# EasyEDA schematic 1-Schematic_Twin-T_Bassdrum_Krakenpine.json
TITLE: Krakenpines Twin-T Bassdrum; REV: 1.0; Date: 2025-04-01; Sheet: 1/1; Drawn By: Tilman
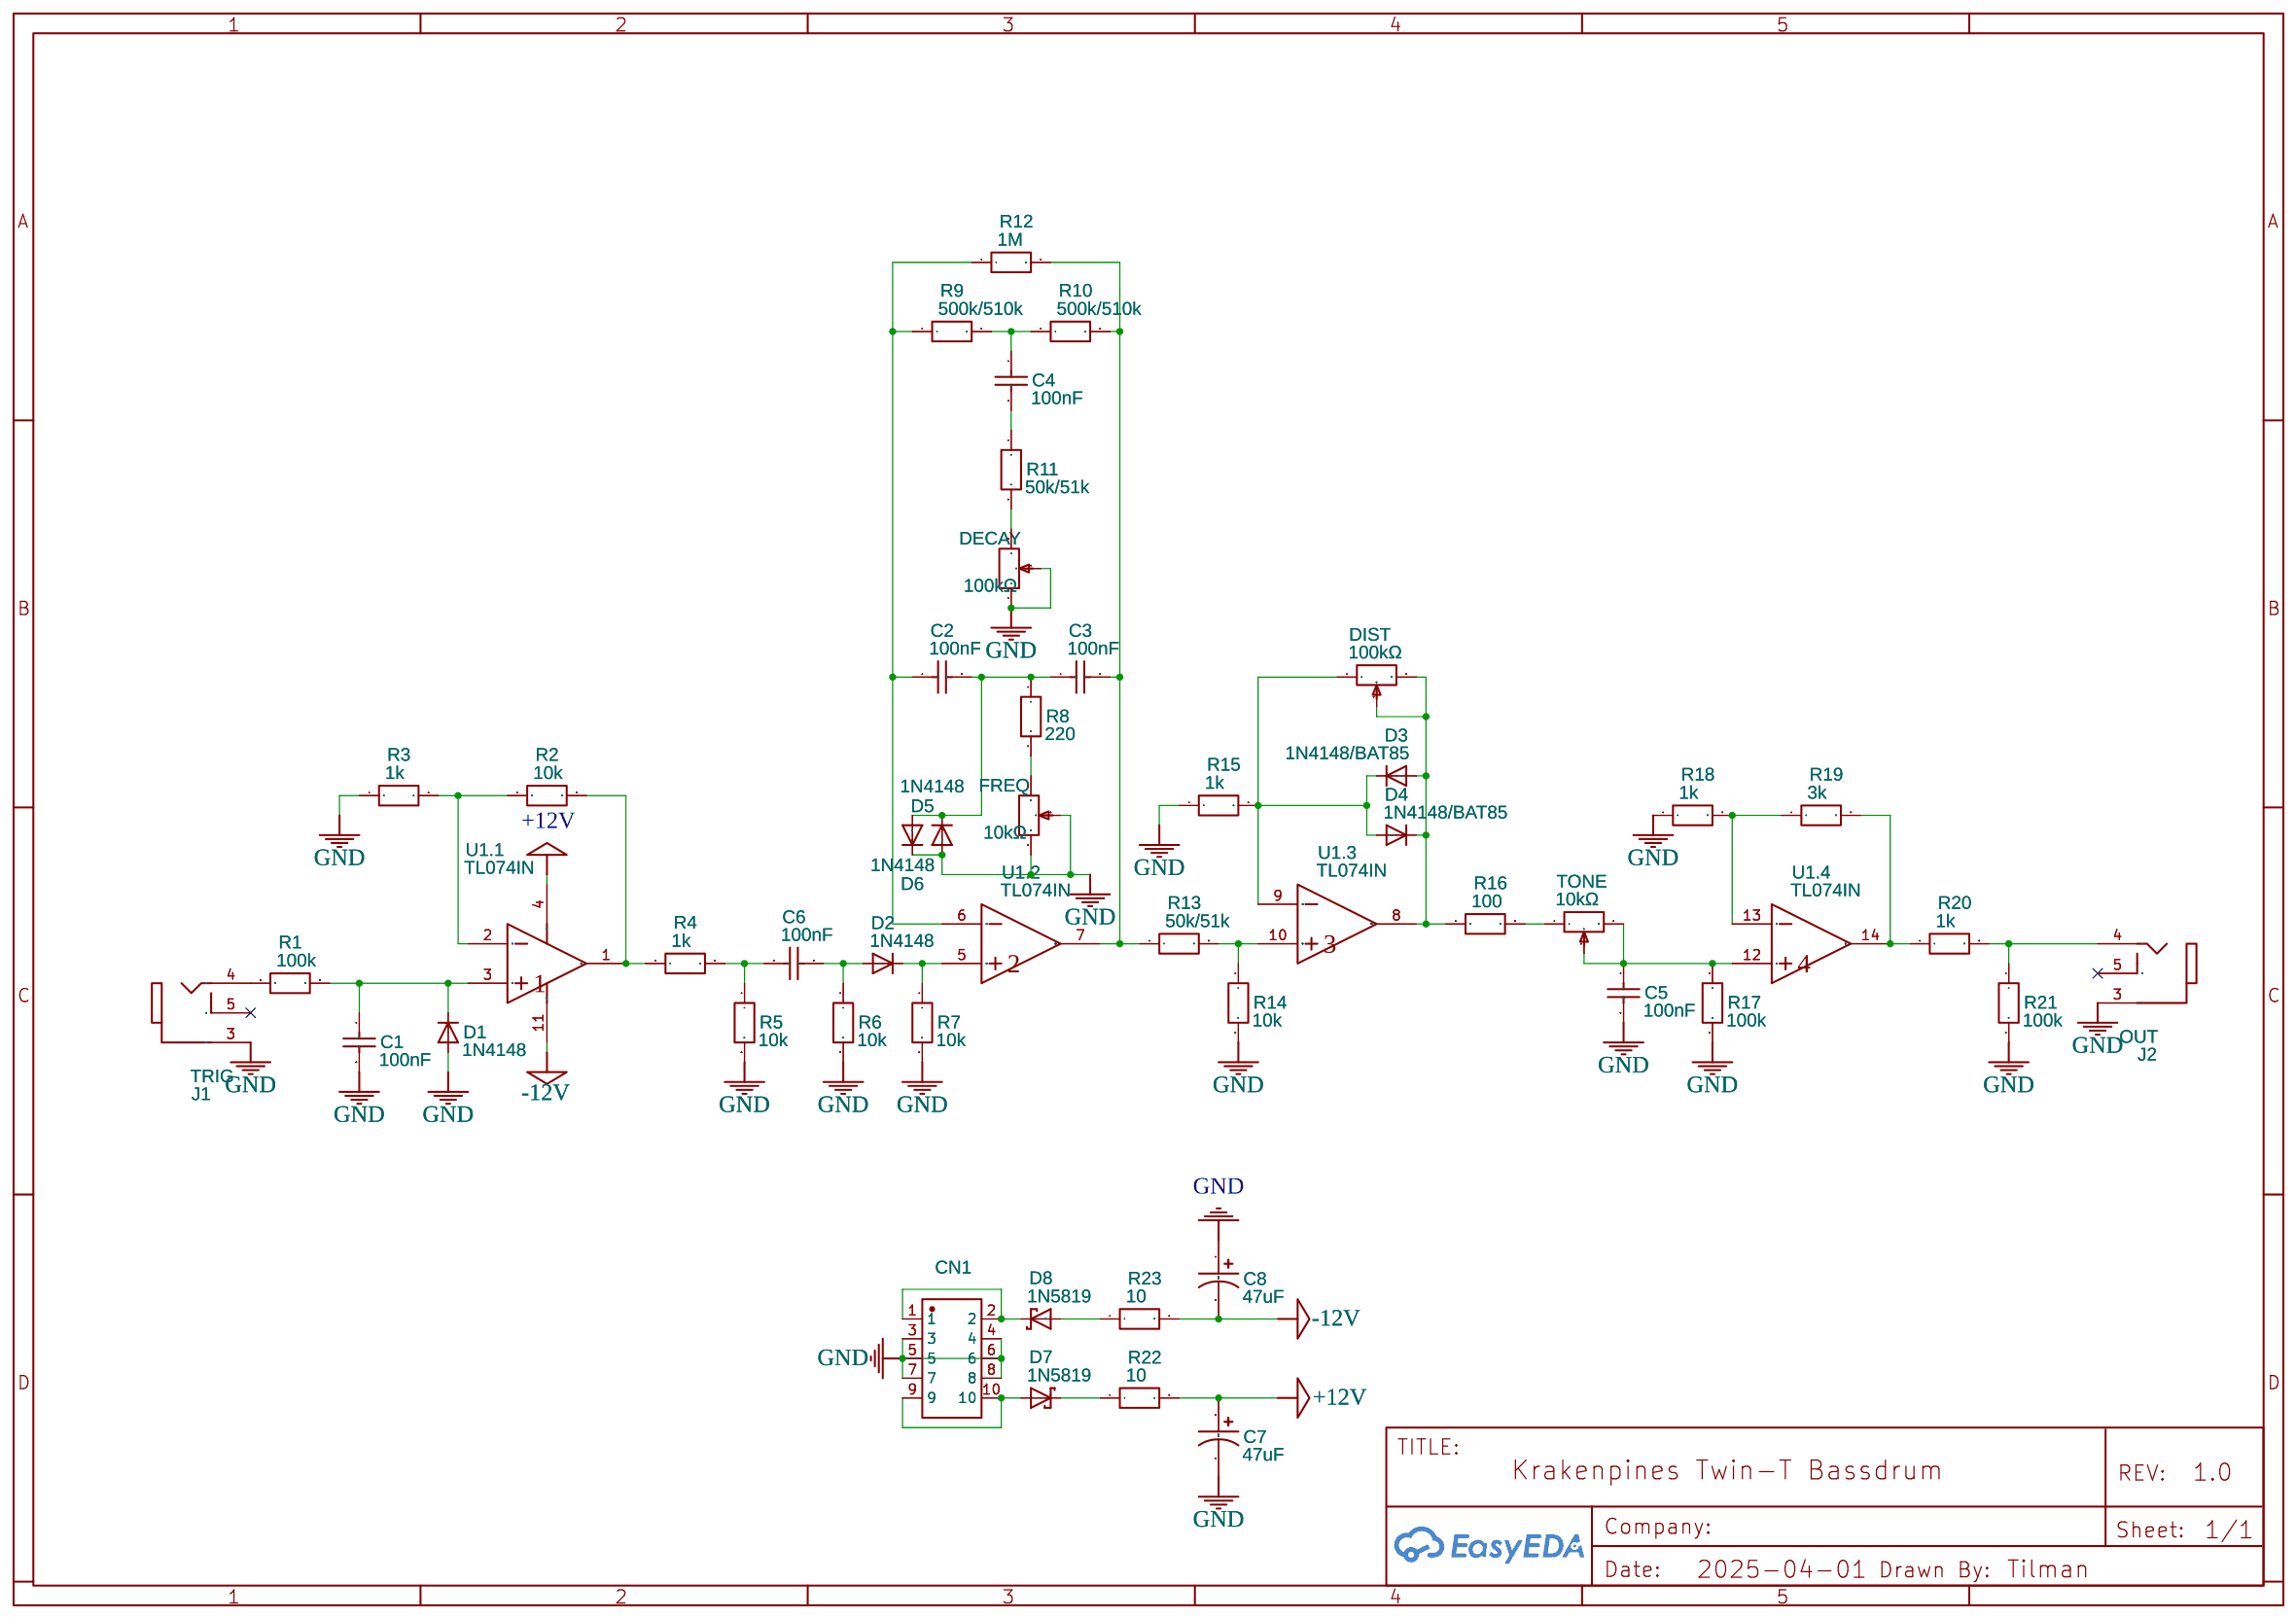
[diagram p0: schematic sheet]

## Parts
C1  100nF  [CAP-2.5*6.5*7.2]
C2  100nF  [CAP-2.5*6.5*7.2]
C3  100nF  [CAP-2.5*6.5*7.2]
C4  100nF  [CAP-2.5*6.5*7.2]
C5  100nF  [CAP-2.5*6.5*7.2]
C6  100nF  [CAP-2.5*6.5*7.2]
C7  47uF  [CAP-TH_BD5.0-P2.00-D0.5-FD]
C8  47uF  [CAP-TH_BD5.0-P2.00-D0.5-FD]
CN1  DC3-2.54-10PAS  [CONN-TH_10P-P2.54_DC3-2.54-10PAS]
D1  1N4148  [DIODE-1N4148]
D2  1N4148  [DIODE-1N4148]
D3  1N4148/BAT85  [DIODE-1N4148]
D4  1N4148/BAT85  [DIODE-1N4148]
D5  1N4148  [DIODE-1N4148]
D6  1N4148  [DIODE-1N4148]
D7  1N5819  [DO41-7.6]
D8  1N5819  [DO41-7.6]
DECAY  100kΩ  [RES-ADJ-TH_RK097111080J]
DIST  100kΩ  [RES-ADJ-TH_RK097111080J]
FREQ  10kΩ  [RES-ADJ-TH_RK097111080J]
J1  TRIG  [PJM323 TAYDA A-2557]
J2  OUT  [PJM323 TAYDA A-2557]
R1  100k  [RES-TH_BD2.4-L6.3-P10.30-D0.6]
R2  10k  [RES-TH_BD2.4-L6.3-P10.30-D0.6]
R3  1k  [RES-TH_BD2.4-L6.3-P10.30-D0.6]
R4  1k  [RES-TH_BD2.4-L6.3-P10.30-D0.6]
R5  10k  [RES-TH_BD2.4-L6.3-P10.30-D0.6]
R6  10k  [RES-TH_BD2.4-L6.3-P10.30-D0.6]
R7  10k  [RES-TH_BD2.4-L6.3-P10.30-D0.6]
R8  220  [RES-TH_BD2.4-L6.3-P10.30-D0.6]
R9  500k/510k  [RES-TH_BD2.4-L6.3-P10.30-D0.6]
R10  500k/510k  [RES-TH_BD2.4-L6.3-P10.30-D0.6]
R11  50k/51k  [RES-TH_BD2.4-L6.3-P10.30-D0.6]
R12  1M  [RES-TH_BD2.4-L6.3-P10.30-D0.6]
R13  50k/51k  [RES-TH_BD2.4-L6.3-P10.30-D0.6]
R14  10k  [RES-TH_BD2.4-L6.3-P10.30-D0.6]
R15  1k  [RES-TH_BD2.4-L6.3-P10.30-D0.6]
R16  100  [RES-TH_BD2.4-L6.3-P10.30-D0.6]
R17  100k  [RES-TH_BD2.4-L6.3-P10.30-D0.6]
R18  1k  [RES-TH_BD2.4-L6.3-P10.30-D0.6]
R19  3k  [RES-TH_BD2.4-L6.3-P10.30-D0.6]
R20  1k  [RES-TH_BD2.4-L6.3-P10.30-D0.6]
R21  100k  [RES-TH_BD2.4-L6.3-P10.30-D0.6]
R22  10  [RES-TH_BD2.4-L6.3-P10.30-D0.6]
R23  10  [RES-TH_BD2.4-L6.3-P10.30-D0.6]
TONE  10kΩ  [RES-ADJ-TH_RK097111080J]
U1  TL074IN  [PDIP-14_L19.3-W6.4-P2.54-LS7.9-BL-1]  (sections 1,2,3,4)

## Library data of the parts
C1-C6 = 0.22uF 5% 100VCalibration capacitor: Supplier Part: undefined; Supplier: LCSC; Manufacturer: ReliaPro
C7 C8 = 50MS710MEFCTZ5X7: Contributor: lcsc; Supplier: LCSC; Supplier Part: C5115261; Manufacturer: rubycon(红宝石)
CN1 = DC3-2.54-10PAS: Contributor: lcsc; Supplier: LCSC; Supplier Part: C2977596; Manufacturer: ZHOURI(洲日); JLCPCB Part Class: Extended Part
D1-D6 = DIODE: Contributor: SparkFun
D7 D8 = 1N5819-B: 1.0A SCHOTTKY BARRIER RECTIFIER
DECAY DIST FREQ TONE = RK097111080J: Resistance(Ohms): 10K; Supplier: LCSC; Manufacturer: ALPSALPINE(阿尔卑斯阿尔派); Supplier Part: C97444; JLCPCB Part Class: Extended Part
J1 J2 = PJ323M Tayda: Supplier: Tayda; Supplier Part: A-2557; Contributor: flounderguts
R1-R23 = Res_AXIAL-0.4(1/4W)_US
U1 = TL074IN: subpart_no: 1; Supplier: LCSC; Supplier Part: C1346811; Manufacturer: TI(德州仪器); JLCPCB Part Class: Extended Part

## Nets
+12V: C7.1 R22.2 U1.4(VCC)
-12V: C8.2 R23.2 U1.11(GND)
GND: C1.2 C5.2 C7.2 C8.1 CN1.3 CN1.4 CN1.5 CN1.6 CN1.7 CN1.8 D1.A D5.A D6.C DECAY.1 DECAY.2 FREQ.1 FREQ.2 J1.3 J2.3 R3.1 R5.2 R6.2 R7.2 R14.2 R15.1 R17.2 R18.1 R21.2
Net-(C1-1): C1.1 D1.C R1.2 U1.3(IN1+)
Net-(C2-1): C2.1 R9.1 R12.1 U1.6(IN2-)
Net-(C2-2): C2.2 C3.1 D5.C D6.A R8.1
Net-(C3-2): C3.2 R10.2 R12.2 R13.1 U1.7(OUT2)
Net-(C4-1): C4.1 R9.2 R10.1
Net-(C4-2): C4.2 R11.1
Net-(C5-1): C5.1 R17.1 TONE.2 TONE.3 U1.12(IN4+)
Net-(C6-1): C6.1 R4.2 R5.1
Net-(C6-2): C6.2 D2.A R6.1
Net-(CN1-1): CN1.1 CN1.2 D8.C
Net-(CN1-9): CN1.9 CN1.10 D7.A
Net-(D2-C): D2.C R7.1 U1.5(IN2+)
Net-(D3-A): D3.A D4.C DIST.2 DIST.3 R16.1 U1.8(OUT3)
Net-(D3-C): D3.C D4.A DIST.1 R15.2 U1.9(IN3-)
Net-(D7-C): D7.C R22.1
Net-(D8-A): D8.A R23.1
Net-(DECAY-3): DECAY.3 R11.2
Net-(FREQ-3): FREQ.3 R8.2
Net-(J1-4): J1.4 R1.1
Net-(J2-4): J2.4 R20.2 R21.1
Net-(R2-1): R2.1 R3.2 U1.2(IN1-)
Net-(R2-2): R2.2 R4.1 U1.1(OUT1)
Net-(R13-2): R13.2 R14.1 U1.10(IN3+)
Net-(R16-2): R16.2 TONE.1
Net-(R18-2): R18.2 R19.1 U1.13(IN4-)
Net-(R19-2): R19.2 R20.1 U1.14(OUT4)

Not connected (* = marked no-connect by the designer): J1 5*; J2 5*
